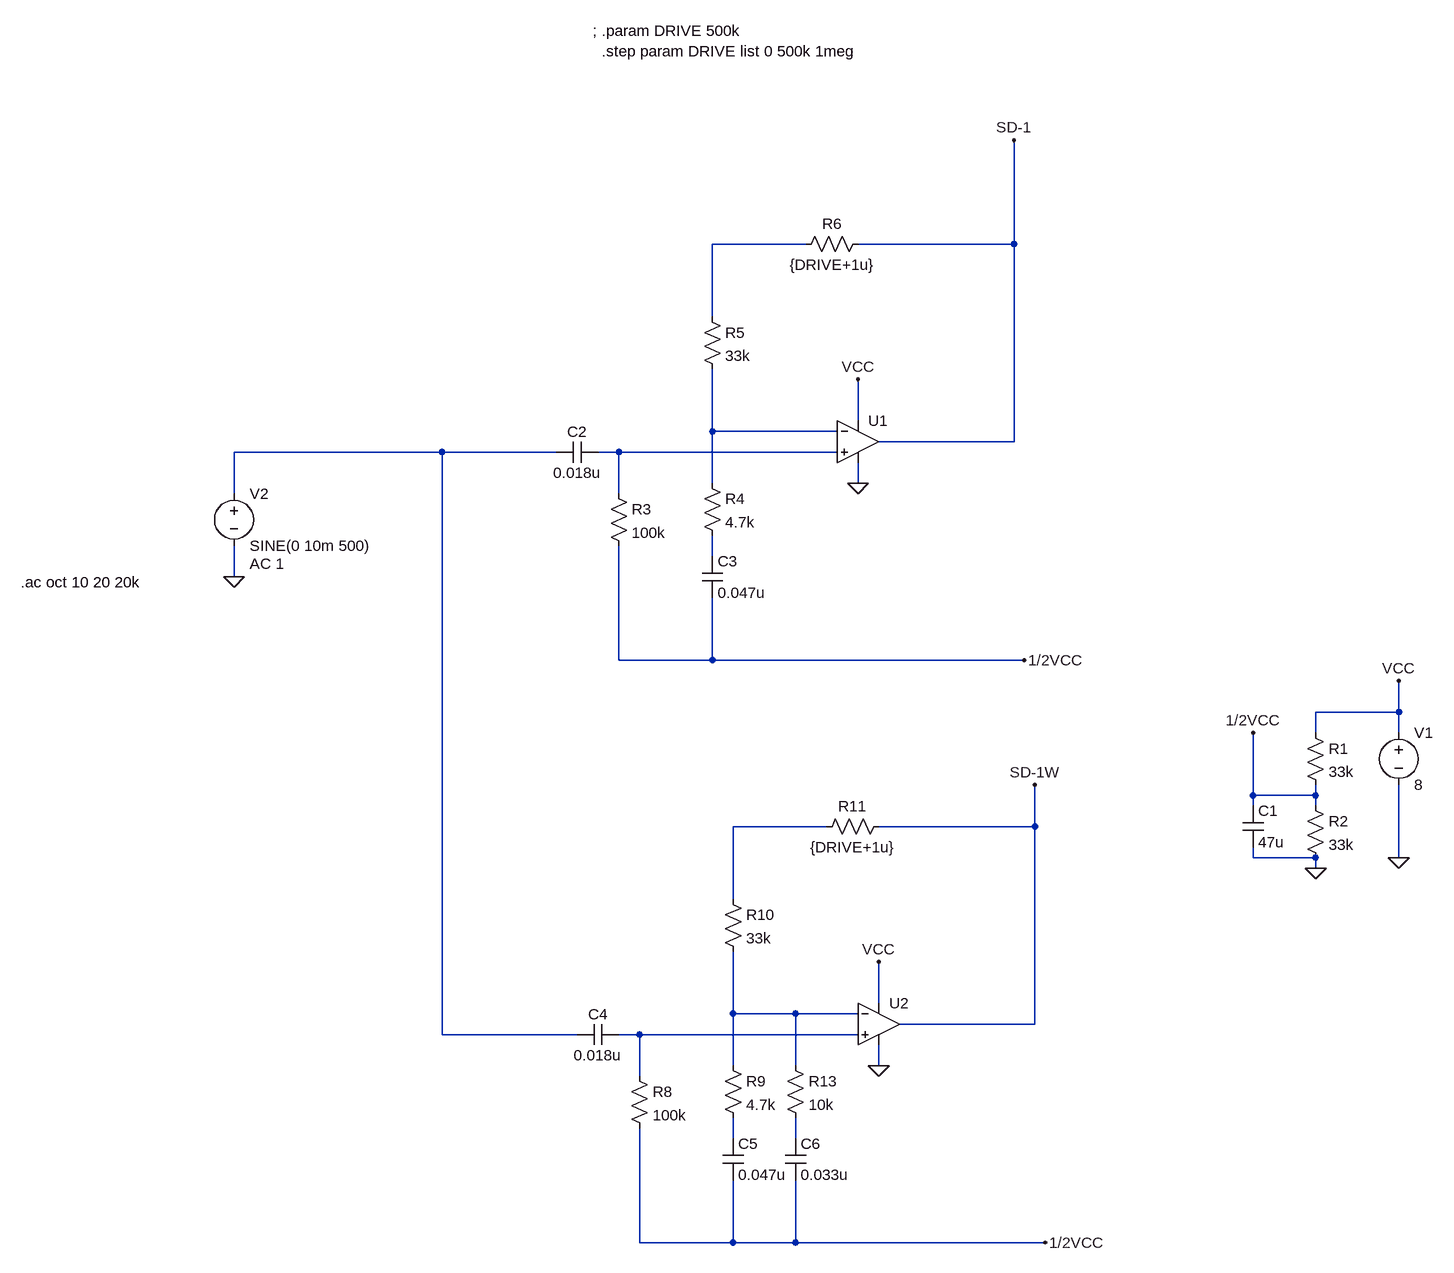
[diagram p0: schematic SD-1_SD-1W_pre.asc]
SD-1_SD-1W_pre.asc, the LTspice schematic file:
Version 4
SHEET 1 1164 1452
WIRE 192 -144 48 -144
WIRE 512 -144 512 -304
WIRE 512 -144 272 -144
WIRE 48 -32 48 -144
WIRE 272 128 272 64
WIRE 48 144 48 48
WIRE 240 144 48 144
WIRE 512 160 512 -144
WIRE 512 160 304 160
WIRE -368 176 -688 176
WIRE -192 176 -368 176
WIRE -96 176 -128 176
WIRE 240 176 -96 176
WIRE 48 224 48 144
WIRE 272 224 272 192
WIRE -688 240 -688 176
WIRE -96 240 -96 176
WIRE 48 336 48 304
WIRE -688 368 -688 320
WIRE -96 496 -96 320
WIRE 48 496 48 400
WIRE 48 496 -96 496
WIRE 528 496 48 496
WIRE 1104 576 1104 528
WIRE 1104 576 976 576
WIRE 976 608 976 576
WIRE 1104 608 1104 576
WIRE 880 704 880 608
WIRE 976 704 976 688
WIRE 976 704 880 704
WIRE 880 720 880 704
WIRE 976 720 976 704
WIRE 224 752 80 752
WIRE 544 752 544 688
WIRE 544 752 304 752
WIRE 880 800 880 784
WIRE 976 800 880 800
WIRE 1104 800 1104 688
WIRE 976 816 976 800
WIRE 80 864 80 752
WIRE 304 1024 304 960
WIRE 80 1040 80 944
WIRE 176 1040 80 1040
WIRE 272 1040 176 1040
WIRE 544 1056 544 752
WIRE 544 1056 336 1056
WIRE -368 1072 -368 176
WIRE -160 1072 -368 1072
WIRE -64 1072 -96 1072
WIRE 272 1072 -64 1072
WIRE 80 1120 80 1040
WIRE 176 1120 176 1040
WIRE 304 1120 304 1088
WIRE -64 1136 -64 1072
WIRE 80 1232 80 1200
WIRE 176 1232 176 1200
WIRE -64 1392 -64 1216
WIRE 80 1392 80 1296
WIRE 80 1392 -64 1392
WIRE 176 1392 176 1296
WIRE 176 1392 80 1392
WIRE 560 1392 176 1392
FLAG 1104 800 0
FLAG 1104 528 VCC
FLAG 976 816 0
FLAG 880 608 1/2VCC
FLAG -688 368 0
FLAG 272 224 0
FLAG 272 64 VCC
FLAG 528 496 1/2VCC
FLAG 304 1120 0
FLAG 304 960 VCC
FLAG 560 1392 1/2VCC
FLAG 512 -304 SD-1
FLAG 544 688 SD-1W
SYMBOL Opamps\\UniversalOpamp2 272 160 R0
SYMATTR InstName U1
SYMBOL voltage 1104 592 R0
WINDOW 123 0 0 Left 2
WINDOW 39 0 0 Left 2
SYMATTR InstName V1
SYMATTR Value 8
SYMBOL res 960 592 R0
SYMATTR InstName R1
SYMATTR Value 33k
SYMBOL res 960 704 R0
SYMATTR InstName R2
SYMATTR Value 33k
SYMBOL cap 864 720 R0
SYMATTR InstName C1
SYMATTR Value 47u
SYMBOL voltage -688 224 R0
WINDOW 123 24 124 Left 2
WINDOW 39 0 0 Left 2
SYMATTR Value2 AC 1
SYMATTR InstName V2
SYMATTR Value SINE(0 10m 500)
SYMBOL res -112 224 R0
SYMATTR InstName R3
SYMATTR Value 100k
SYMBOL cap -128 160 R90
WINDOW 0 0 32 VBottom 2
WINDOW 3 32 32 VTop 2
SYMATTR InstName C2
SYMATTR Value 0.018u
SYMBOL res 32 208 R0
SYMATTR InstName R4
SYMATTR Value 4.7k
SYMBOL cap 32 336 R0
SYMATTR InstName C3
SYMATTR Value 0.047u
SYMBOL res 32 -48 R0
SYMATTR InstName R5
SYMATTR Value 33k
SYMBOL res 288 -160 R90
WINDOW 0 0 56 VBottom 2
WINDOW 3 32 56 VTop 2
SYMATTR InstName R6
SYMATTR Value {DRIVE+1u}
SYMBOL Opamps\\UniversalOpamp2 304 1056 R0
SYMATTR InstName U2
SYMBOL res -80 1120 R0
SYMATTR InstName R8
SYMATTR Value 100k
SYMBOL cap -96 1056 R90
WINDOW 0 0 32 VBottom 2
WINDOW 3 32 32 VTop 2
SYMATTR InstName C4
SYMATTR Value 0.018u
SYMBOL res 64 1104 R0
SYMATTR InstName R9
SYMATTR Value 4.7k
SYMBOL cap 64 1232 R0
SYMATTR InstName C5
SYMATTR Value 0.047u
SYMBOL res 64 848 R0
SYMATTR InstName R10
SYMATTR Value 33k
SYMBOL res 320 736 R90
WINDOW 0 0 56 VBottom 2
WINDOW 3 32 56 VTop 2
SYMATTR InstName R11
SYMATTR Value {DRIVE+1u}
SYMBOL res 160 1104 R0
SYMATTR InstName R13
SYMATTR Value 10k
SYMBOL cap 160 1232 R0
SYMATTR InstName C6
SYMATTR Value 0.033u
TEXT -136 -472 Left 2 !; .param DRIVE 500k\n  .step param DRIVE list 0 500k 1meg
TEXT -1016 376 Left 2 !.ac oct 10 20 20k

The netlist it stands for:
* SD-1_SD-1W_pre.asc
XU1 N004 N002 VCC 0 SD-1 level.2 Avol=1Meg GBW=10Meg Slew=10Meg ilimit=25m rail=0 Vos=0 phimargin=45 en=0 enk=0 in=0 ink=0 Rin=500Meg  ; pins IN+ IN- V+ V- OUT
V1 VCC 0 8
R1 VCC 1/2VCC 33k
R2 1/2VCC 0 33k
C1 1/2VCC 0 47u
V2 N003 0 SINE(0 10m 500) AC 1
R3 N004 1/2VCC 100k
C2 N004 N003 0.018u
R4 N002 N005 4.7k
C3 N005 1/2VCC 0.047u
R5 N001 N002 33k
R6 SD-1 N001 {DRIVE+1u}
XU2 N008 N007 VCC 0 SD-1W level.2 Avol=1Meg GBW=10Meg Slew=10Meg ilimit=25m rail=0 Vos=0 phimargin=45 en=0 enk=0 in=0 ink=0 Rin=500Meg  ; pins IN+ IN- V+ V- OUT
R8 N008 1/2VCC 100k
C4 N008 N003 0.018u
R9 N007 N009 4.7k
C5 N009 1/2VCC 0.047u
R10 N006 N007 33k
R11 SD-1W N006 {DRIVE+1u}
R13 N007 N010 10k
C6 N010 1/2VCC 0.033u
; .param DRIVE 500k
  .step param DRIVE list 0 500k 1meg
.ac oct 10 20 20k
.lib UniversalOpamps2.sub
.backanno
.end